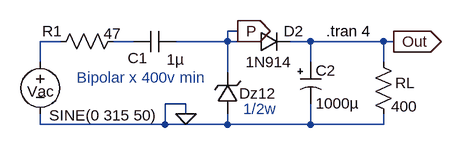
[diagram p0: schematic SinTrafoMin.asc]
SinTrafoMin.asc, the LTspice schematic file:
Version 4
SHEET 1 880 680
WIRE 224 224 208 224
WIRE -48 240 -80 240
WIRE 64 240 32 240
WIRE 208 240 208 224
WIRE 208 240 128 240
WIRE 240 240 208 240
WIRE 336 240 304 240
WIRE 448 240 336 240
WIRE 464 240 448 240
WIRE -80 272 -80 240
WIRE 336 272 336 240
WIRE 448 272 448 240
WIRE 208 288 208 240
WIRE 144 336 112 336
WIRE 144 352 144 336
WIRE -80 368 -80 352
WIRE 112 368 112 336
WIRE 112 368 -80 368
WIRE 208 368 208 352
WIRE 208 368 112 368
WIRE 336 368 336 336
WIRE 336 368 208 368
WIRE 448 368 448 352
WIRE 448 368 336 368
FLAG 144 352 0
FLAG 464 240 Out
IOPIN 464 240 Out
FLAG 224 224 P
IOPIN 224 224 Out
SYMBOL voltage -80 256 R0
WINDOW 3 14 98 Left 0
WINDOW 123 0 0 Left 0
WINDOW 39 0 0 Left 0
WINDOW 0 -20 61 Left 0
SYMATTR Value SINE(0 315 50)
SYMATTR InstName Vac
SYMBOL Miscel\\zener 224 352 R180
WINDOW 0 -58 32 Left 0
WINDOW 3 -35 -20 Invisible 0
SYMATTR InstName Dz12
SYMATTR Value BZX84C12L
SYMBOL diode 240 256 R270
WINDOW 0 16 70 VTop 0
WINDOW 3 0 32 VBottom 0
SYMATTR InstName D2
SYMATTR Value 1N914
SYMBOL res -64 256 R270
WINDOW 0 16 2 VTop 0
WINDOW 3 44 95 VBottom 0
SYMATTR InstName R1
SYMATTR Value 47
SYMBOL cap 128 224 R90
WINDOW 0 57 58 VBottom 0
WINDOW 3 28 0 VTop 0
SYMATTR InstName C1
SYMATTR Value 1µ
SYMBOL polcap 320 272 R0
WINDOW 0 24 13 Left 0
WINDOW 3 24 64 Left 0
SYMATTR InstName C2
SYMATTR Value 1000µ
SYMATTR Description Capacitor
SYMATTR Type cap
SYMATTR SpiceLine V=16 Irms=1.41 Rser=0.047 MTBF=5000 Lser=0 mfg="Nichicon" pn="UPL1C102MPH" type="Al electrolytic" ppPkg=1
SYMBOL res 432 256 R0
WINDOW 0 34 48 Left 0
WINDOW 3 28 84 Left 0
SYMATTR InstName RL
SYMATTR Value 400
TEXT 360 224 Left 0 !.tran 4
TEXT -24 296 Left 0 ;Bipolar x 400v min
TEXT 232 344 Left 0 ;1/2w

The netlist it stands for:
* SinTrafoMin.asc
Vac N001 0 SINE(0 315 50)
Dz12 0 P BZX84C12L
D2 P Out 1N914
R1 N001 N002 47
C1 P N002 1µ
C2 Out 0 1000µ V=16 Irms=1.41 Rser=0.047 MTBF=5000 Lser=0 mfg="Nichicon" pn="UPL1C102MPH" type="Al electrolytic" ppPkg=1
RL Out 0 400
.model D D
.lib standard.dio
.tran 4
* Bipolar x 400v min
* 1/2w
.backanno
.end